# Altium schematic sheet FTDIChip.SchDoc
size A
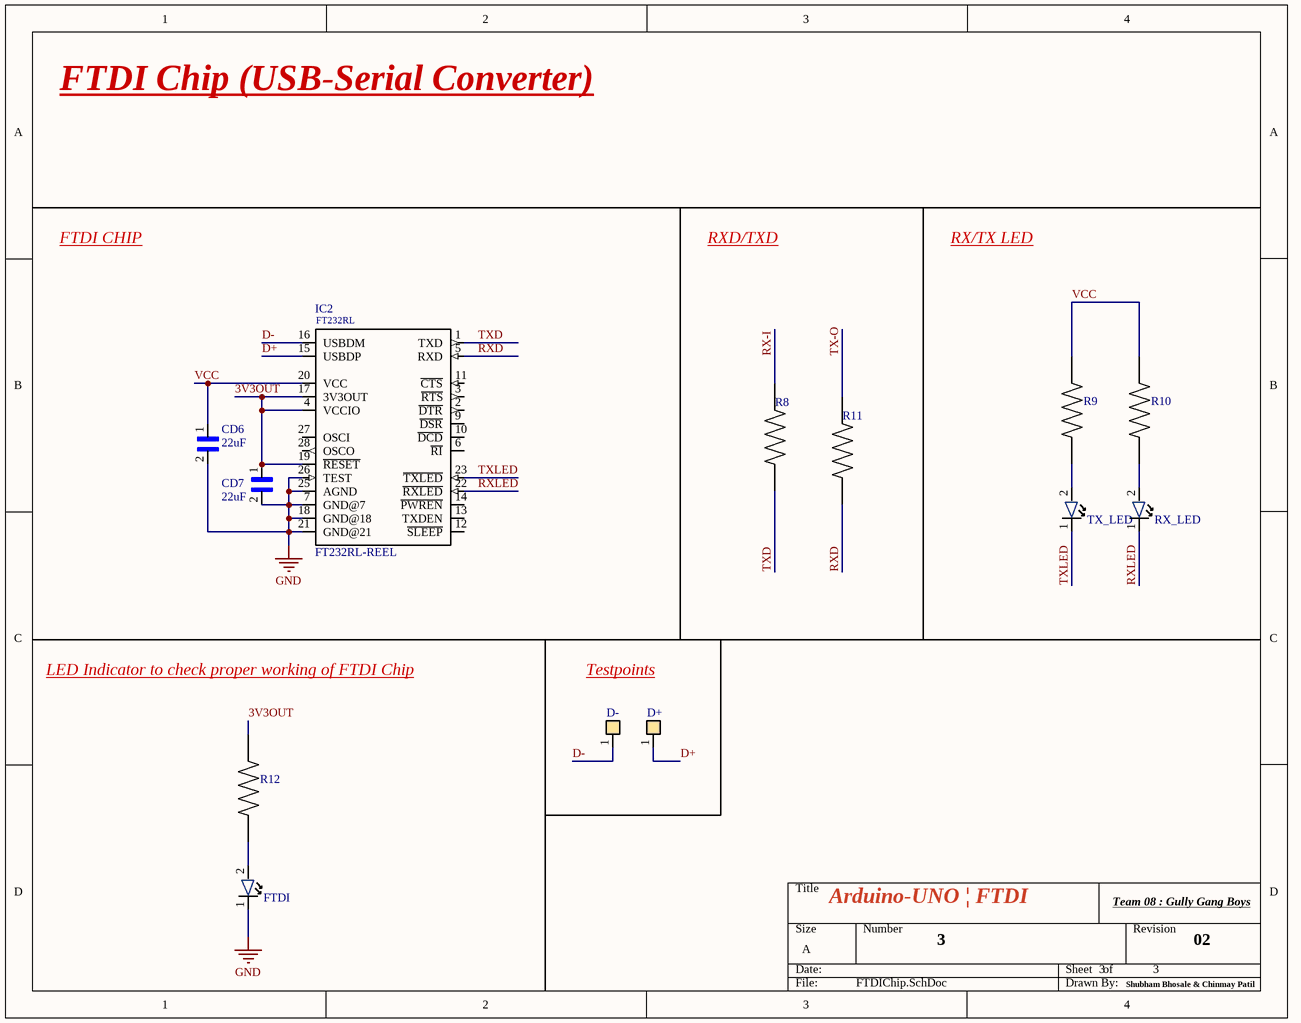
[diagram p0: FTDIChip.SchDoc]

## Parts
CD6  22uF  [1206_Passive]
CD7  22uF  [1206_Passive]
D+  TESTPOINT  [TEST POINT]  (value not drawn)
D-  TESTPOINT  [TEST POINT]  (value not drawn)
FTDI  LTST-C150CKT  [LED]  (value not drawn)
IC2  FT232RL-REEL  [FTDI]
R8  RNCP1206FTD1K00  [1206_Passive]  (value not drawn)
R9  RNCP1206FTD1K00  [1206_Passive]  (value not drawn)
R10  RNCP1206FTD1K00  [1206_Passive]  (value not drawn)
R11  RNCP1206FTD1K00  [1206_Passive]  (value not drawn)
R12  RNCP1206FTD1K00  [1206_Passive]  (value not drawn)
RX_LED  LTST-C150CKT  [LED]  (value not drawn)
TX_LED  LTST-C150CKT  [LED]  (value not drawn)

## Nets
GND: CD6.2 CD7.2 FTDI.1 IC2.7(GND@7) IC2.18(GND@18) IC2.21(GND@21) IC2.25(AGND) IC2.26(TEST)
3V3OUT: CD7.1 IC2.4(VCCIO) IC2.17(3V3OUT) IC2.19(~{RESET}) R12.1
D+: D+.1 IC2.15(USBDP)
D-: D-.1 IC2.16(USBDM)
RX-I: R8.2
RXD: IC2.5(RXD) R11.1
RXLED: IC2.22(~{RXLED}) RX_LED.1
TX-O: R11.2
TXD: IC2.1(TXD) R8.1
TXLED: IC2.23(~{TXLED}) TX_LED.1
VCC: CD6.1 IC2.20(VCC) R9.1 R10.1
NetFTDI_2: FTDI.2 R12.2
NetR9_2: R9.2 TX_LED.2
NetR10_2: R10.2 RX_LED.2

Not connected (* = marked no-connect by the designer): IC2 2(~{DTR}) 3(~{RTS}) 6(~{RI}) 9(~{DSR}) 10(~{DCD}) 11(~{CTS}) 12(~{SLEEP}) 13(TXDEN) 14(~{PWREN}) 27(OSCI) 28(OSCO)

## Notes on the sheet
- FTDI Chip (USB-Serial Converter)
- FTDI CHIP
- RXD/TXD
- RX/TX LED
- LED Indicator to check proper working of FTDI Chip
- Testpoints
- Arduino-UNO | FTDI
- Team 08 : Gully Gang Boys
- 3
- 02
- Shubham Bhosale & Chinmay Patil
- (in symbol FTDI) FT232RL

## Library data of the parts
CD6 CD7 = 1206_22uF: 22µF ±20% 16V Ceramic Capacitor X5R 1206 (3216 Metric); Value: CAP CER 22UF 16V X5R 1206; Digikey Link: https://www.digikey.com/product-detail/en/CL31A226MOCLNNC/1276-2728-1-ND/3890814/?itemSeq=304982363; Digikey Part: 1276-2728-1-ND
D+ D- = TEST POINT
FTDI RX_LED TX_LED = 1206_RED_LED: Red 638nm LED Indication - Discrete 1.8V 1206 (3216 Metric); Value: LED RED CLEAR 1206 SMD; Digikey Link: https://www.digikey.com/product-detail/en/LTST-C150CKT/160-1167-1-ND/269239/?itemSeq=304982368; Digikey Part: 160-1167-1-ND
IC2 = FTDI: USB Bridge, USB to UART USB 2.0 UART Interface 28-SSOP; Value: IC USB FS SERIAL UART 28-SSOP; Digikey Part: 768-1007-1-ND; Digikey Link: https://www.digikey.com/product-detail/en/FT232RL-REEL/768-1007-1-ND/1836402/?itemSeq=304982359
R8-R12 = 1206_1K: 1 kOhms ±1% 0.5W, 1/2W Chip Resistor 1206 (3216 Metric) Anti-Sulfur, Moisture Resistant Thin Film; Value: RES 1K OHM 1% 1/2W 1206; Digikey Link: https://www.digikey.com/product-detail/en/RNCP1206FTD1K00/RNCP1206FTD1K00CT-ND/2240675/?itemSeq=304982373; Digikey Part: RNCP1206FTD1K00CT-ND